# EAGLE design module_instr_reg (EAGLE 6.5.0)

## Sheet 1 of 4
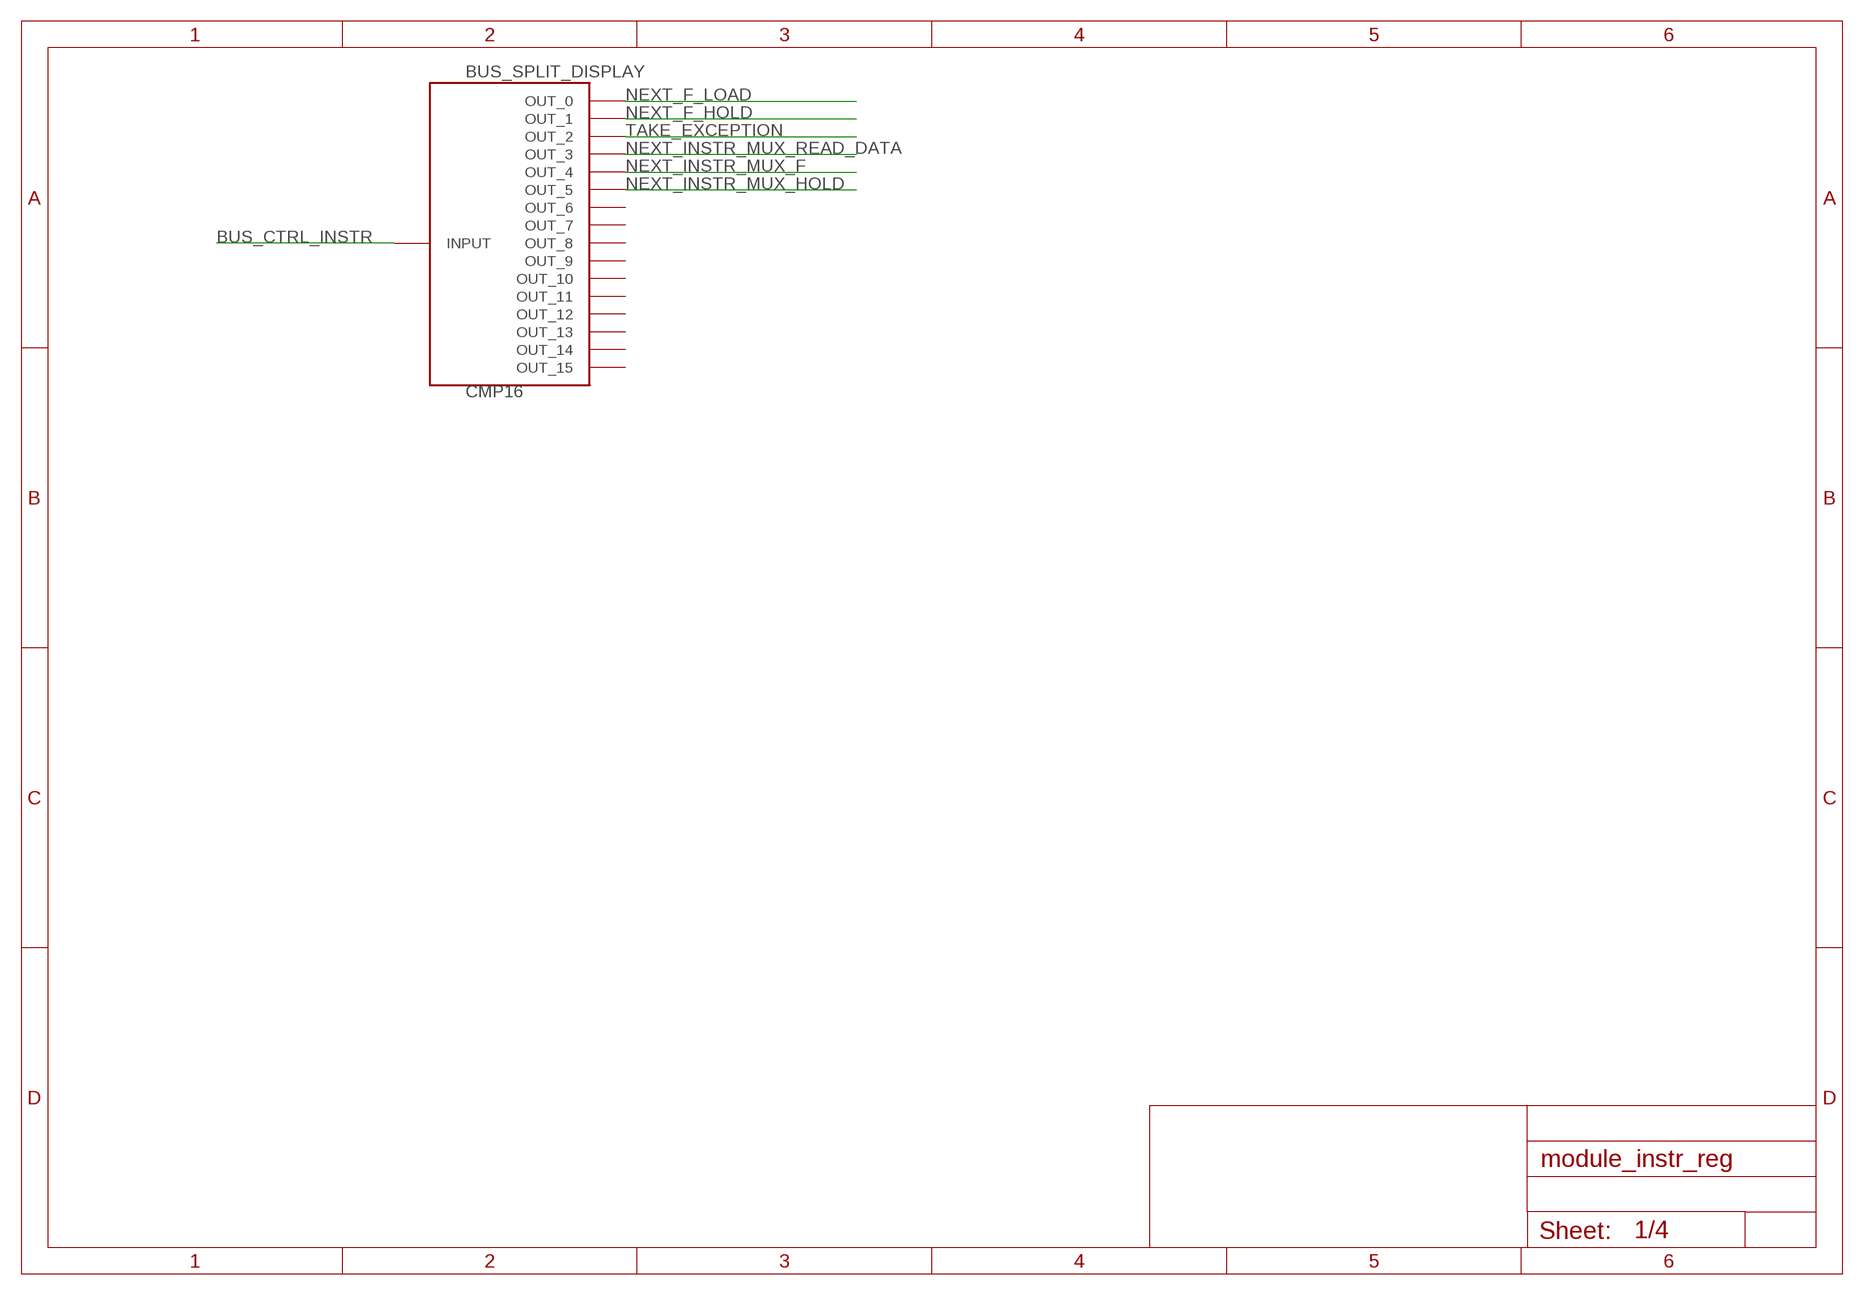
[diagram p0: schematic, sheet 1]

### Parts
CMP16  BUS_SPLIT_DISPLAY  [BUS_SPLIT_DISPLAY]

### Nets
BUS_CTRL_INSTR: CMP16.INPUT
NEXT_F_HOLD: CMP16.P$2(OUT_1) ; also sheet 2
NEXT_F_LOAD: CMP16.P$1(OUT_0) ; also sheet 2
NEXT_INSTR_MUX_F: CMP16.P$5(OUT_4) ; also sheet 2
NEXT_INSTR_MUX_HOLD: CMP16.P$6(OUT_5) ; also sheet 2
NEXT_INSTR_MUX_READ_DATA: CMP16.P$4(OUT_3) ; also sheet 2
TAKE_EXCEPTION: CMP16.P$3(OUT_2) ; also sheet 2
Unconnected: CMP16.P$7(OUT_6) CMP16.P$8(OUT_7) CMP16.P$9(OUT_8) CMP16.P$10(OUT_9) CMP16.P$11(OUT_10) CMP16.P$12(OUT_11) CMP16.P$13(OUT_12) CMP16.P$14(OUT_13) CMP16.P$15(OUT_14) CMP16.P$16(OUT_15)

## Sheet 2 of 4
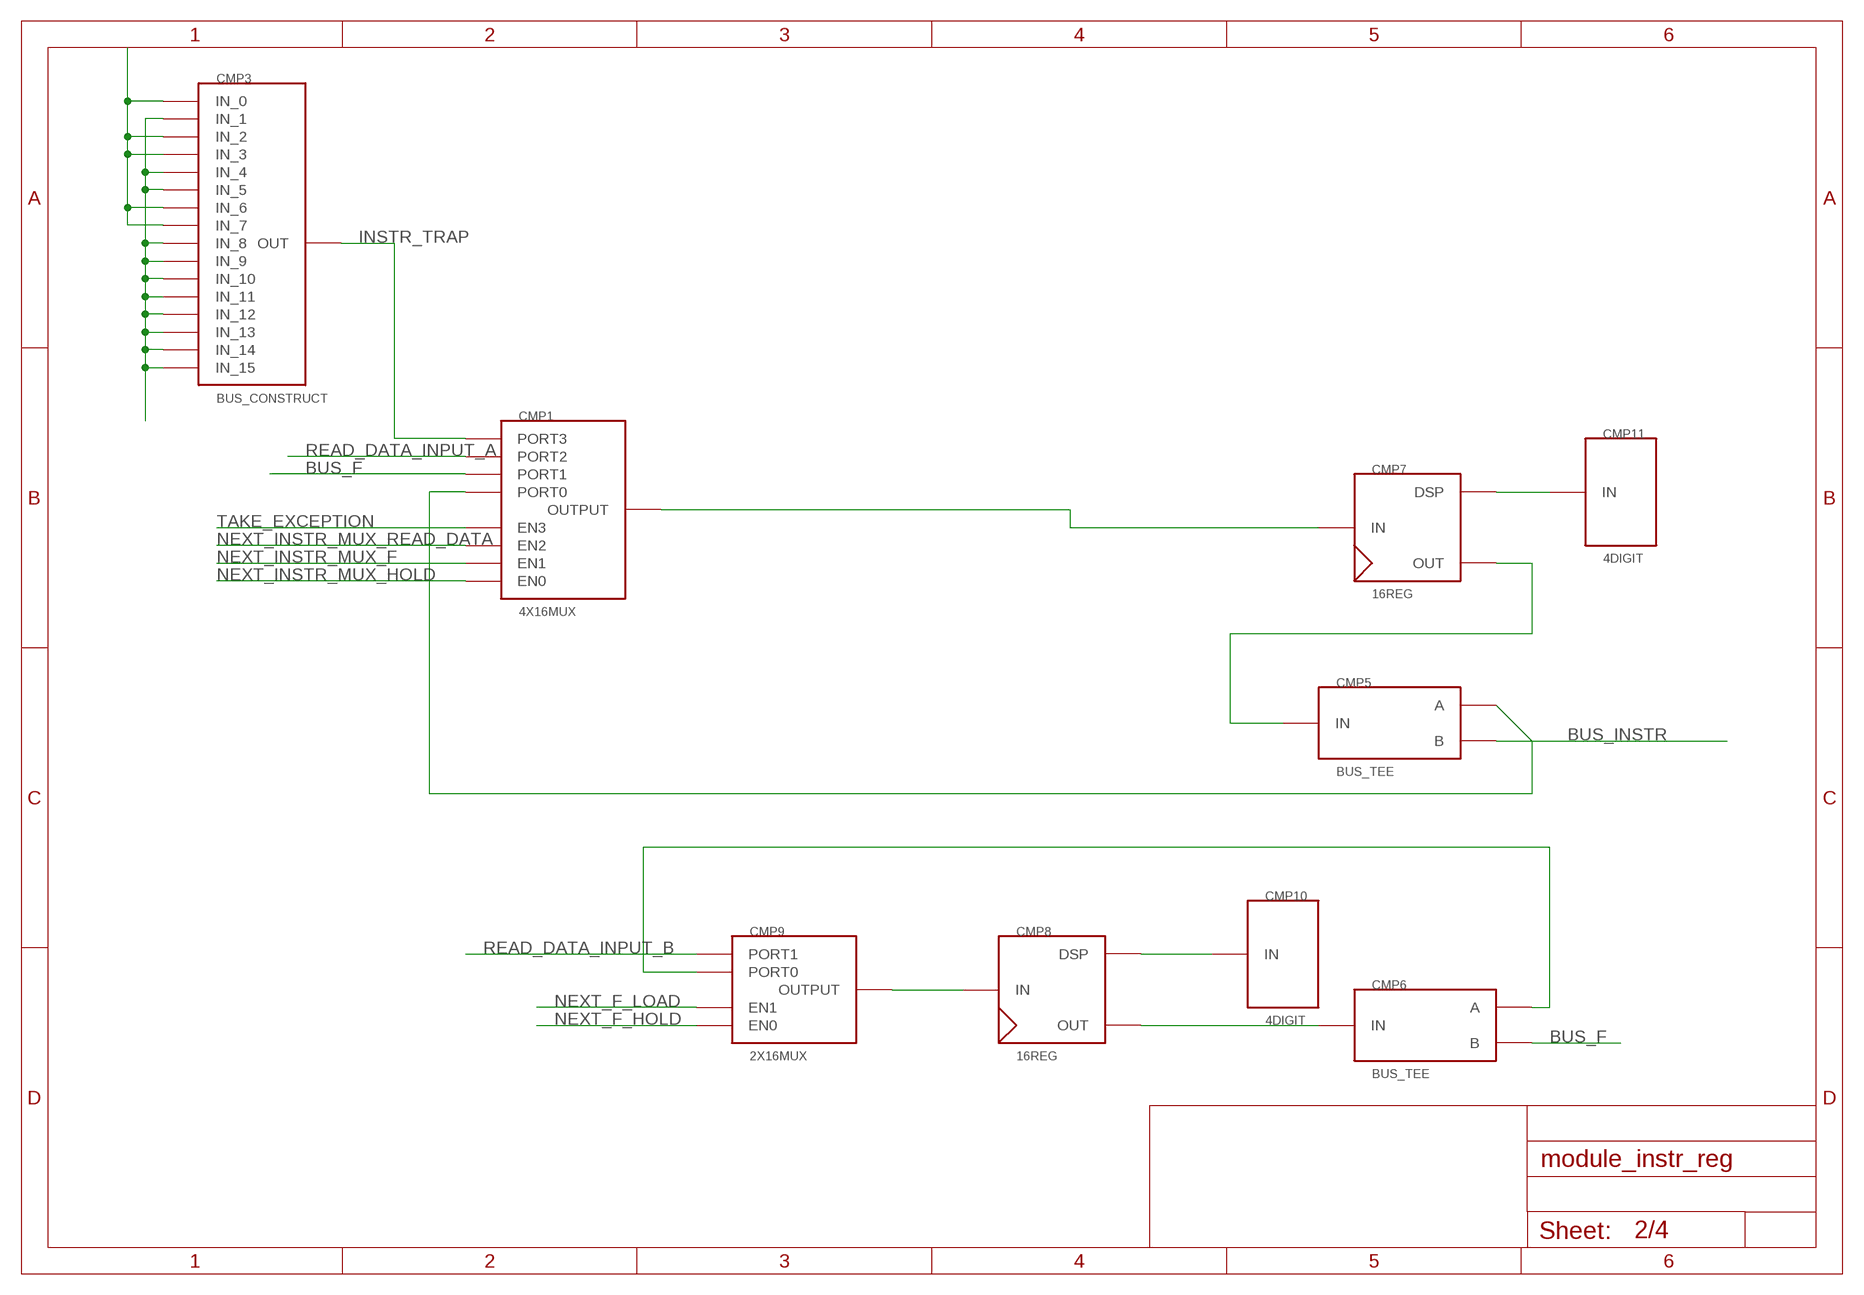
[diagram p1: schematic, sheet 2]

### Parts
CMP1  4X16MUX  [4X16MUX]
CMP3  BUS_CONSTRUCT  [BUS_SPLIT]
CMP5  BUS_TEE  [BUS_TEE]
CMP6  BUS_TEE  [BUS_TEE]
CMP7  16REG  [16REG]
CMP8  16REG  [16REG]
CMP9  2X16MUX  [2X16MUX]
CMP10  4DIGIT  [4DIGIT]
CMP11  4DIGIT  [4DIGIT]

### Nets
BUS_F: CMP1.PORT1 CMP6.OUTB(B)
BUS_INSTR: CMP5.OUTB(B) ; also sheet 4
INSTR_TRAP: CMP1.PORT3 CMP3.INPUT(OUT)
N$2: CMP8.INPUT(IN) CMP9.OUT(OUTPUT)
N$3: CMP8.DISPLAY(DSP) CMP10.P$1(IN)
N$4: CMP6.OUT_A(A) CMP9.PORT0
N$5: CMP1.PORTOUT(OUTPUT) CMP7.INPUT(IN)
N$8: CMP6.INPUT(IN) CMP8.OUT
N$11: CMP1.PORT0 CMP5.OUT_A(A)
N$19: CMP7.DISPLAY(DSP) CMP11.P$1(IN)
N$20: CMP5.INPUT(IN) CMP7.OUT
N$36: CMP3.P$2(IN_1) CMP3.P$5(IN_4) CMP3.P$6(IN_5) CMP3.P$9(IN_8) CMP3.P$10(IN_9) CMP3.P$11(IN_10) CMP3.P$12(IN_11) CMP3.P$13(IN_12) CMP3.P$14(IN_13) CMP3.P$15(IN_14) CMP3.P$16(IN_15)
N$37: CMP3.P$1(IN_0) CMP3.P$3(IN_2) CMP3.P$4(IN_3) CMP3.P$7(IN_6) CMP3.P$8(IN_7)
NEXT_F_HOLD: CMP9.EN0 ; also sheet 1
NEXT_F_LOAD: CMP9.EN1 ; also sheet 1
NEXT_INSTR_MUX_F: CMP1.EN1 ; also sheet 1
NEXT_INSTR_MUX_HOLD: CMP1.EN0 ; also sheet 1
NEXT_INSTR_MUX_READ_DATA: CMP1.EN2 ; also sheet 1
READ_DATA_INPUT_A: CMP1.PORT2 ; also sheet 3
READ_DATA_INPUT_B: CMP9.PORT1 ; also sheet 3
TAKE_EXCEPTION: CMP1.EN3 ; also sheet 1

## Sheet 3 of 4
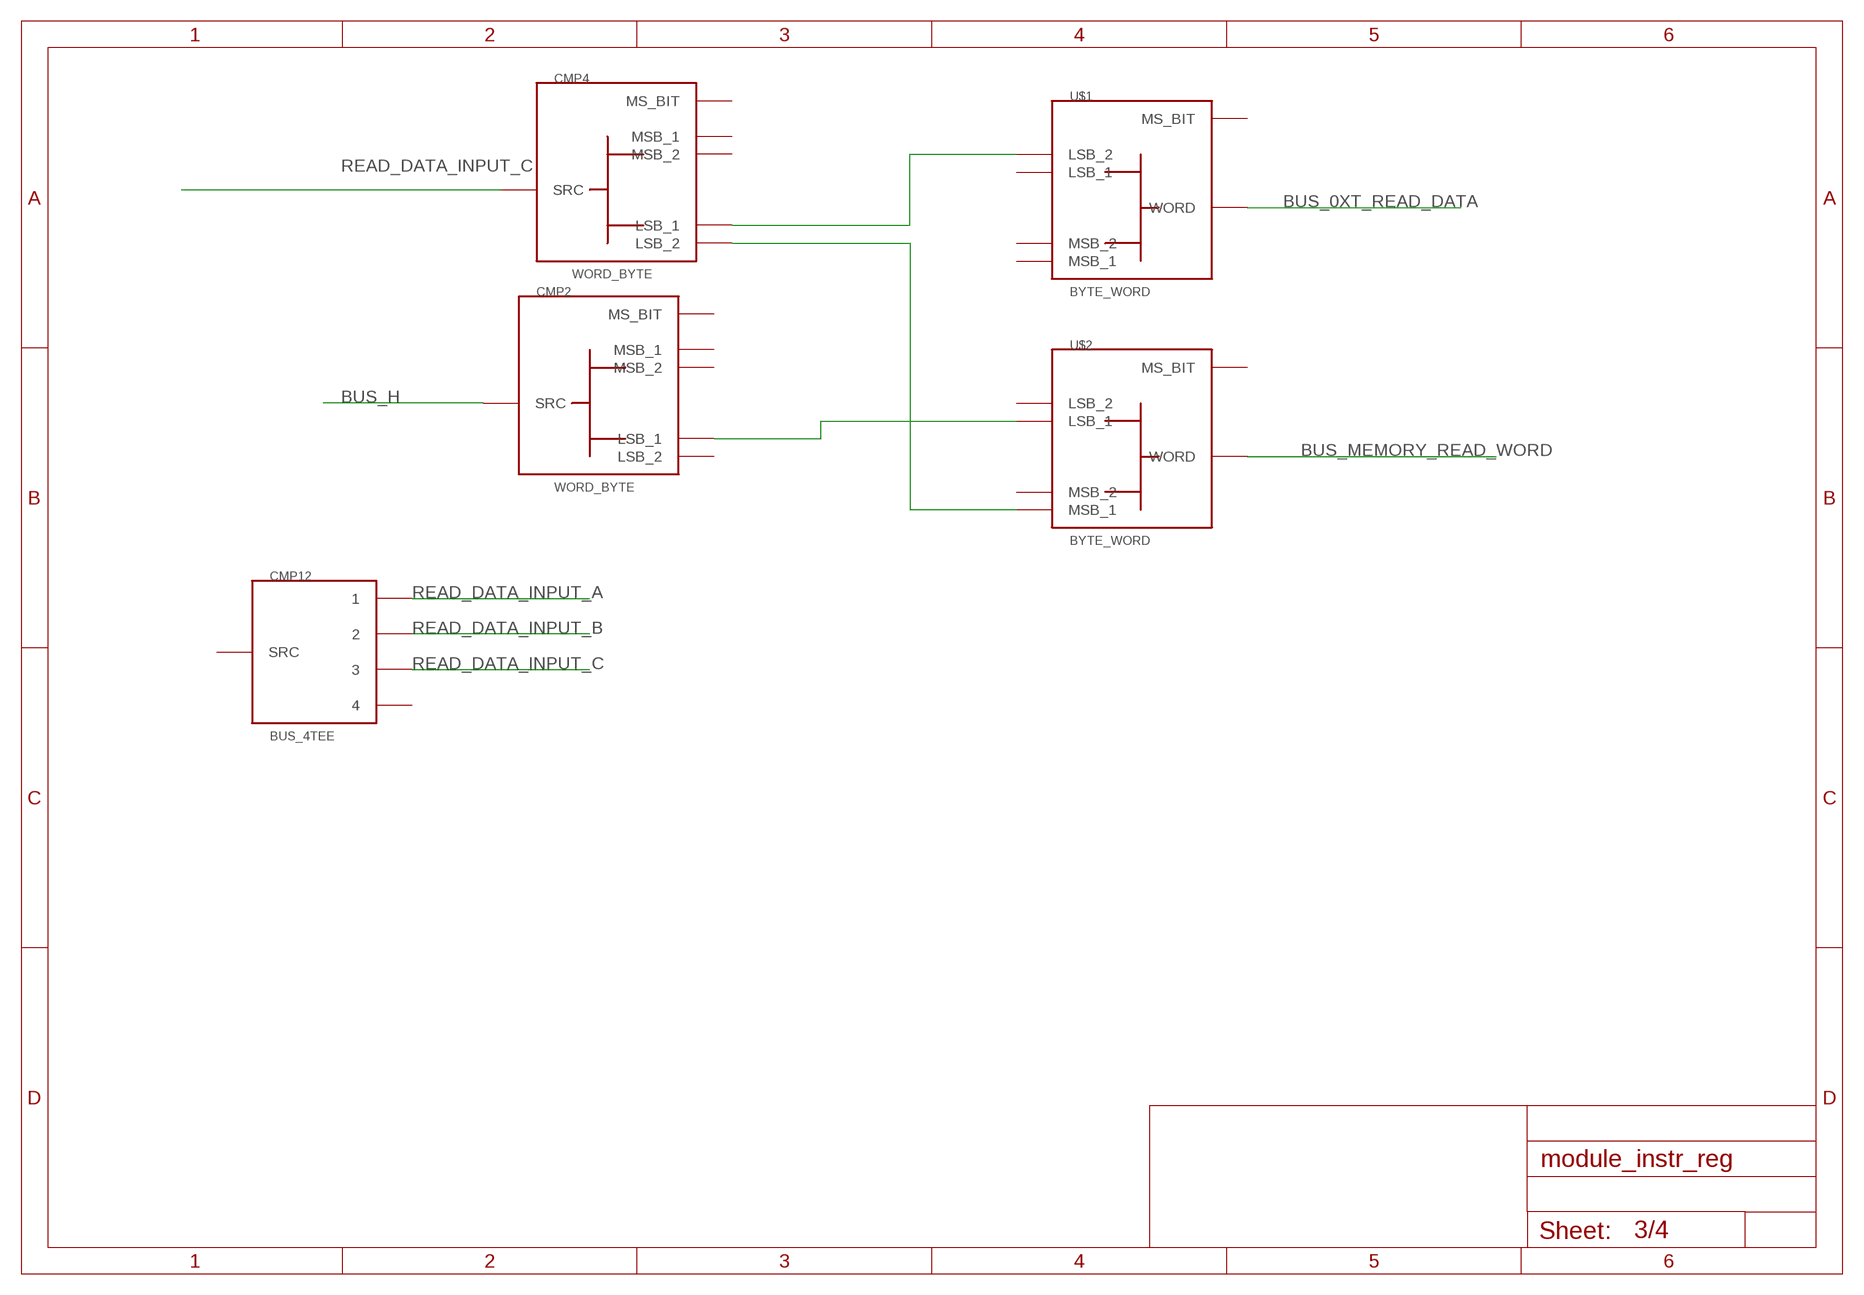
[diagram p2: schematic, sheet 3]

### Parts
CMP2  WORD_BYTE  [WORD_BYTE]
CMP4  WORD_BYTE  [WORD_BYTE]
CMP12  BUS_4TEE  [BUS_4TEE]
U$1  BYTE_WORD  [WORD_BYTE]
U$2  BYTE_WORD  [WORD_BYTE]

### Nets
BUS_0XT_READ_DATA: U$1.SRC(WORD)
BUS_H: CMP2.SRC
BUS_MEMORY_READ_WORD: U$2.SRC(WORD)
N$16: CMP2.LSB_1 U$2.LSB_1
N$18: CMP4.LSB_1 U$1.LSB_2
N$30: CMP4.LSB_2 U$2.MSB_1
READ_DATA_INPUT_A: CMP12.1 ; also sheet 2
READ_DATA_INPUT_B: CMP12.2 ; also sheet 2
READ_DATA_INPUT_C: CMP4.SRC CMP12.3
Unconnected: CMP2.LSB_2 CMP2.MS_BIT CMP2.MSB_1 CMP2.MSB_2 CMP4.MS_BIT CMP4.MSB_1 CMP4.MSB_2 CMP12.4 CMP12.SRC U$1.LSB_1 U$1.MS_BIT U$1.MSB_1 U$1.MSB_2 U$2.LSB_2 U$2.MS_BIT U$2.MSB_2

## Sheet 4 of 4
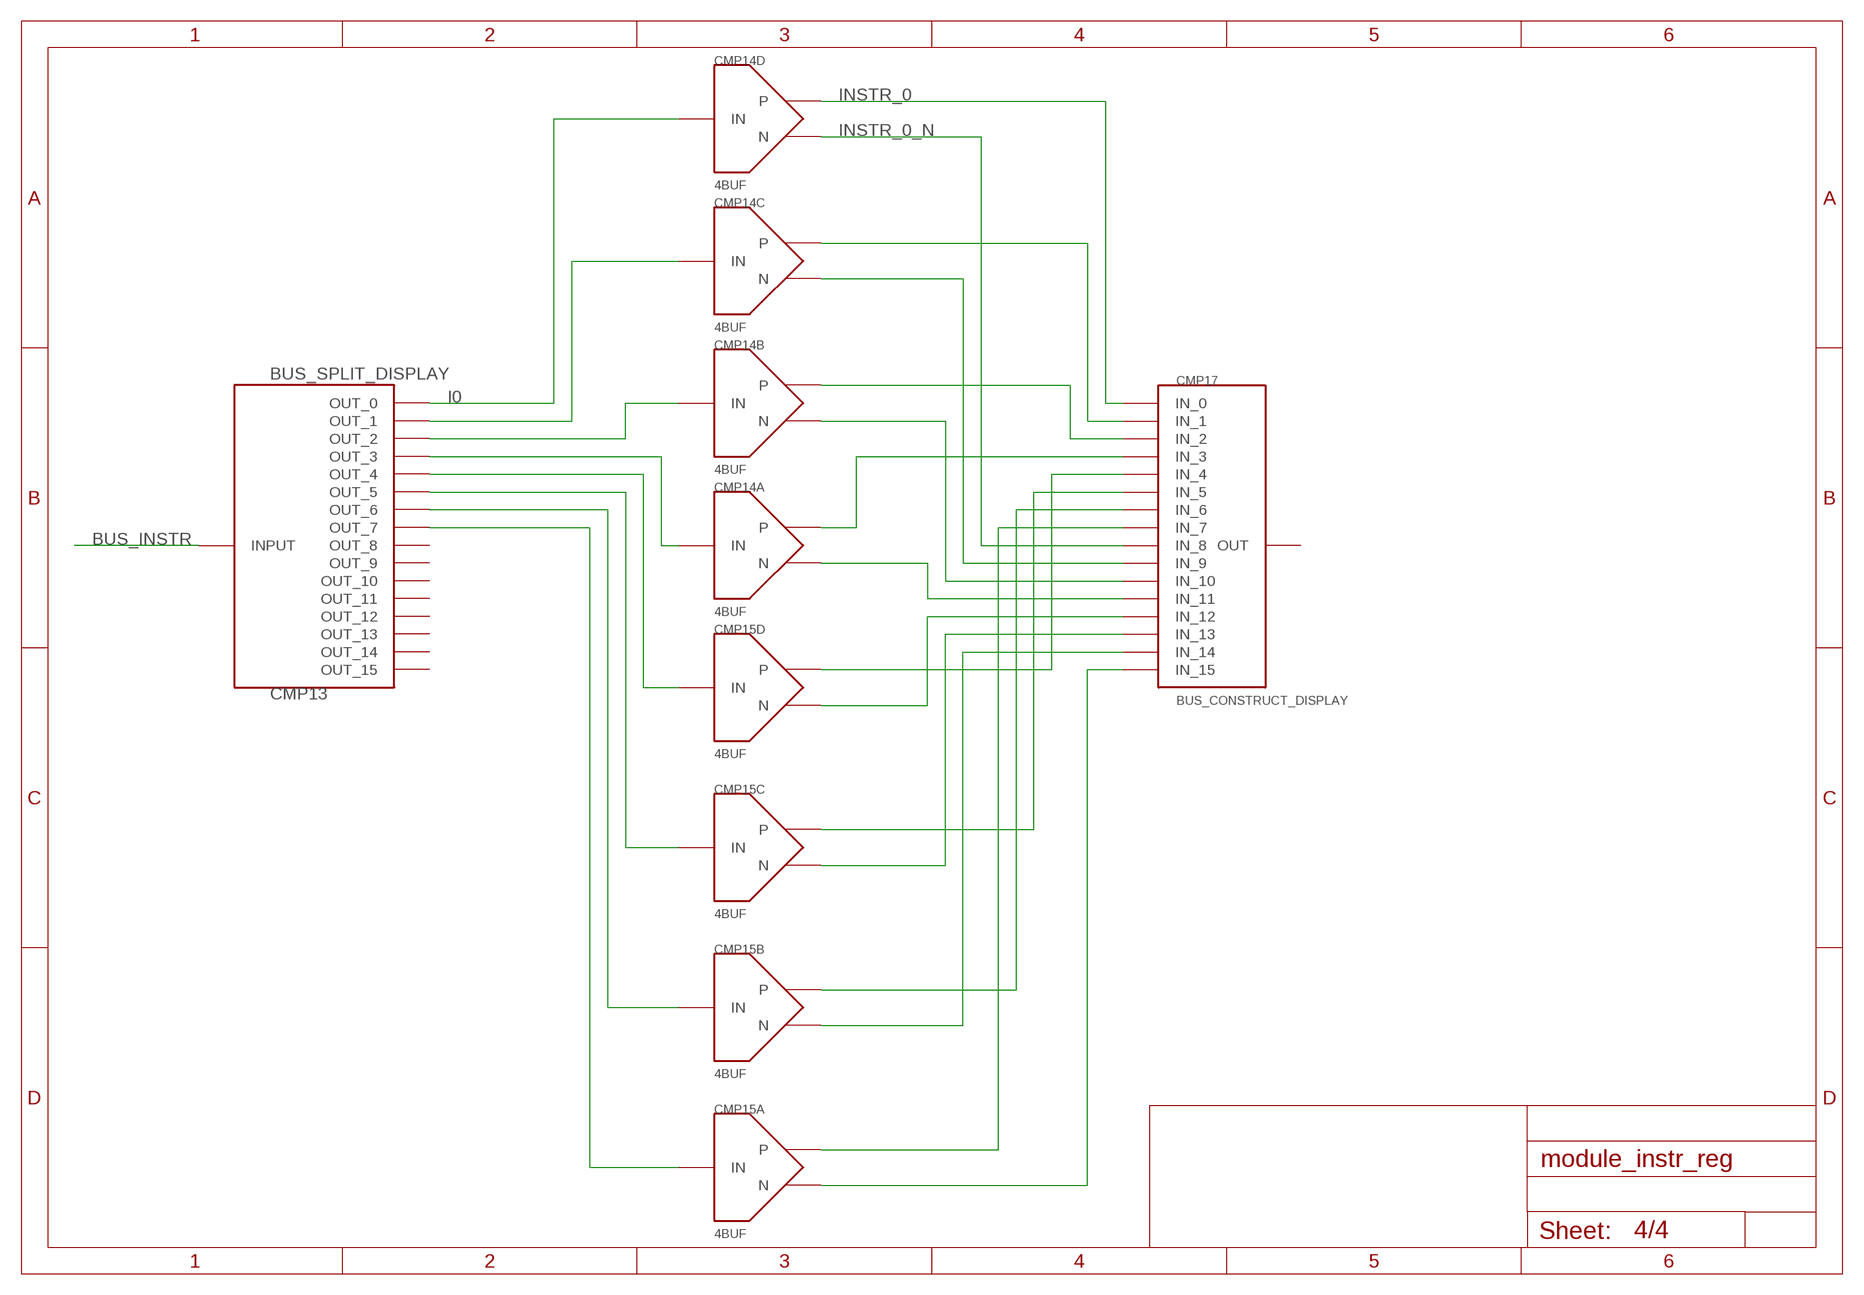
[diagram p3: schematic, sheet 4]

### Parts
CMP13  BUS_SPLIT_DISPLAY  [BUS_SPLIT_DISPLAY]
CMP14  4BUF  [4BUF]
CMP15  4BUF  [4BUF]
CMP17  BUS_CONSTRUCT_DISPLAY  [BUS_SPLIT_DISPLAY]

### Nets
BUS_INSTR: CMP13.INPUT ; also sheet 2
I0: CMP13.P$1(OUT_0) CMP14.A4(D:IN)
INSTR_0: CMP14.P4(D:P) CMP17.P$1(IN_0)
INSTR_0_N: CMP14.N4(D:N) CMP17.P$9(IN_8)
N$6: CMP13.P$2(OUT_1) CMP14.A3(C:IN)
N$7: CMP13.P$3(OUT_2) CMP14.A2(B:IN)
N$9: CMP13.P$4(OUT_3) CMP14.A1(A:IN)
N$10: CMP13.P$5(OUT_4) CMP15.A4(D:IN)
N$12: CMP13.P$6(OUT_5) CMP15.A3(C:IN)
N$13: CMP13.P$7(OUT_6) CMP15.A2(B:IN)
N$14: CMP13.P$8(OUT_7) CMP15.A1(A:IN)
N$17: CMP14.P3(C:P) CMP17.P$2(IN_1)
N$21: CMP14.P2(B:P) CMP17.P$3(IN_2)
N$22: CMP14.P1(A:P) CMP17.P$4(IN_3)
N$23: CMP15.P4(D:P) CMP17.P$5(IN_4)
N$24: CMP15.P3(C:P) CMP17.P$6(IN_5)
N$25: CMP15.P2(B:P) CMP17.P$7(IN_6)
N$26: CMP15.P1(A:P) CMP17.P$8(IN_7)
N$28: CMP14.N3(C:N) CMP17.P$10(IN_9)
N$29: CMP14.N2(B:N) CMP17.P$11(IN_10)
N$31: CMP14.N1(A:N) CMP17.P$12(IN_11)
N$32: CMP15.N4(D:N) CMP17.P$13(IN_12)
N$33: CMP15.N3(C:N) CMP17.P$14(IN_13)
N$34: CMP15.N2(B:N) CMP17.P$15(IN_14)
N$35: CMP15.N1(A:N) CMP17.P$16(IN_15)
Unconnected: CMP13.P$9(OUT_8) CMP13.P$10(OUT_9) CMP13.P$11(OUT_10) CMP13.P$12(OUT_11) CMP13.P$13(OUT_12) CMP13.P$14(OUT_13) CMP13.P$15(OUT_14) CMP13.P$16(OUT_15) CMP17.INPUT(OUT)

## Library data of the parts
CMP1 = modules:4X16MUX
CMP2 CMP4 = modules:WORD_BYTE
CMP3 = modules:BUS_CONSTRUCT
CMP5 CMP6 = modules:BUS_TEE
CMP7 CMP8 = modules:16REG
CMP9 = modules:2X16MUX
CMP10 CMP11 = modules:4DIGIT
CMP12 = modules:BUS_4TEE
CMP13 CMP16 = modules:BUS_SPLIT_DISPLAY
CMP14 CMP15 = modules:4BUF
CMP17 = modules:BUS_CONSTRUCT_DISPLAY
U$1 U$2 = modules:BYTE_WORD

## Board
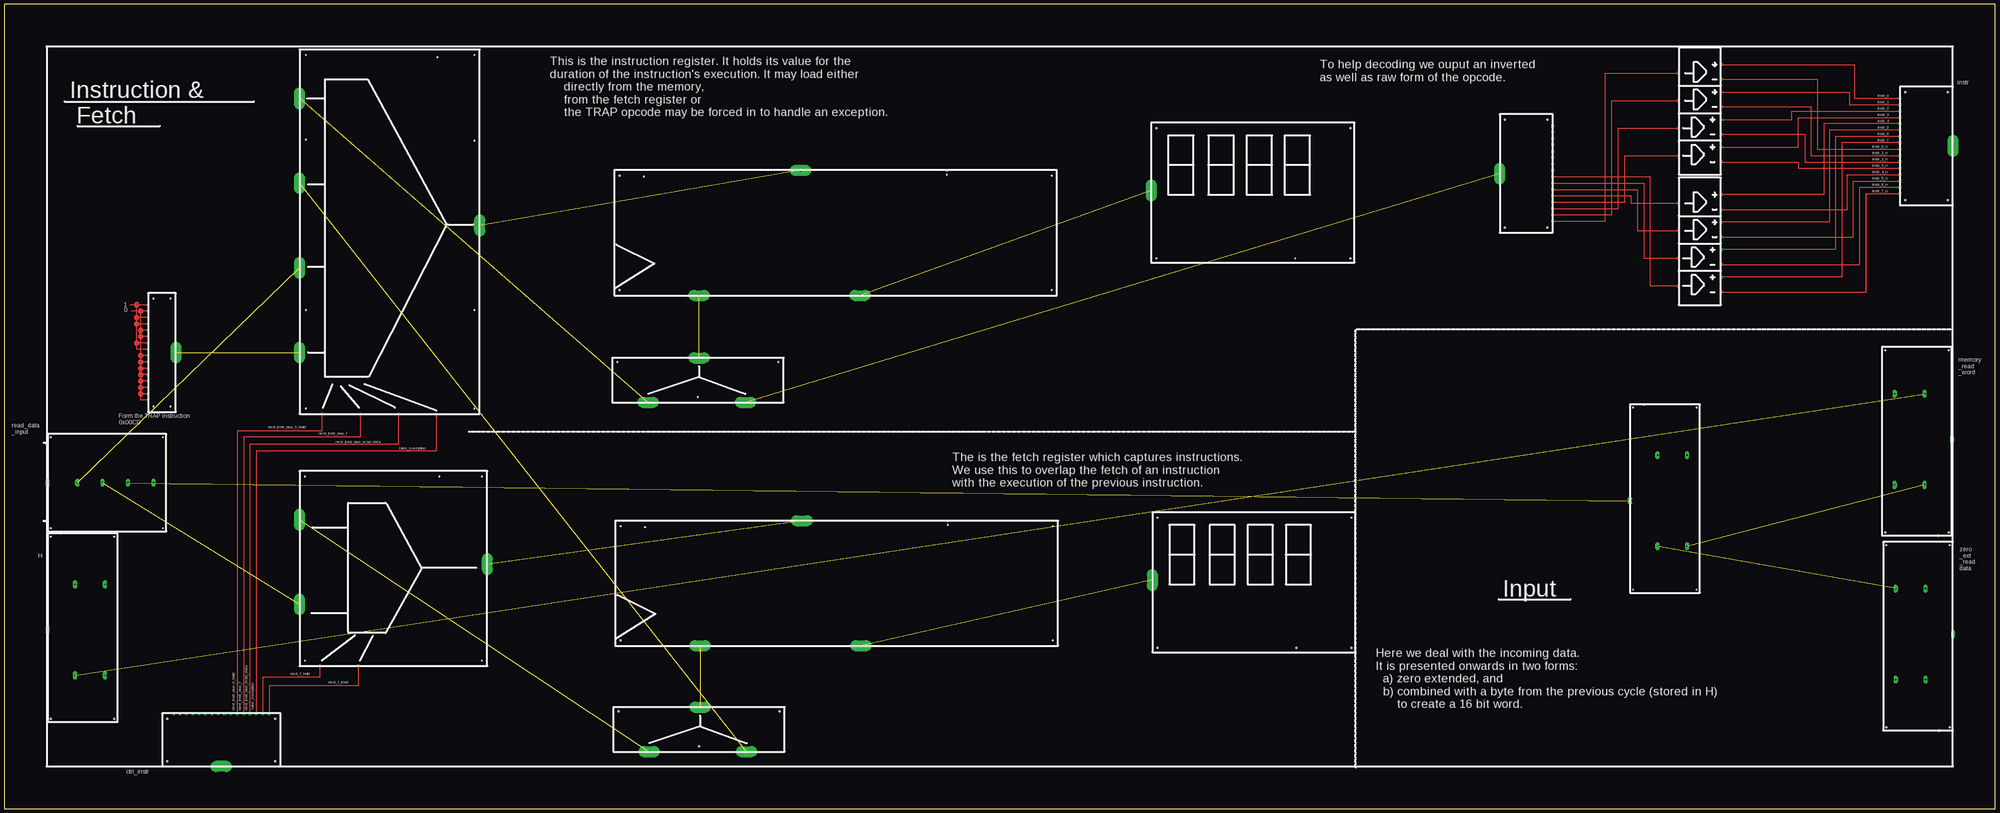
[diagram p4: board, top side]

Size 1193.8 x 482.6 mm. Coordinates in mm from the lower left corner, seen from the top.
Outline: 0,0 1193.8,0 1193.8,482.6 0,482.6 0,0
Copper layers (1*16): Top 0.035mm / dielectric 1.5mm / Bottom 0.035mm
Design rules "default": minimum track width 10mil, minimum drill 24mil, track to track 8mil, track to pad 8mil, pad to pad 8mil, via to via 8mil, smd to smd 8mil, copper to edge 40mil, drill to drill 8mil, minimum pad ring 10mil, minimum via ring 8mil, stop-mask expansion 4mil, vias tented up to drill 0mil, thermal gap 10mil
tKeepout: area 16.4,16.4 to 34.4,34.4; area 16.4,448.2 to 34.4,466.2; area 587.9,16.4 to 605.9,34.4; area 587.9,448.2 to 605.9,466.2; area 1159.4,16.4 to 1177.4,34.4; area 1159.4,448.2 to 1177.4,466.2

### Footprints (pad centres in the part's own frame; a part is rotated, then mirrored left to right if it is on the bottom)
4X16MUX = drill 0.8 square: EN0 -113.03,38.735; EN1 -113.03,15.875; EN2 -113.03,-6.985; EN3 -113.03,-29.845 | drill 0.8 pad 6.452 long: PORT0 76.2,52.07; PORT1 25.4,52.07; PORT2 -25.4,52.07; PORT3 -76.2,52.07; PORTOUT 0,-55.88 | hole 0.6: -109.855,-52.705; -50.8,-52.705; 50.8,-52.705; 102.235,-52.705; 102.235,48.26; 51.435,48.26; -50.8,48.26; -109.855,48.26; 100.965,-30.48
WORD_BYTE = drill 0.8 pad 2.54 long: LSB_1 -29.21,3.81; LSB_2 -29.21,-13.97; MSB_1 25.4,3.81; MSB_2 25.4,-13.97; SRC -1.905,20.32 | drill 0.8 square: MS_BIT 55.88,12.065 | hole 0.6: -55.245,-19.685; -55.245,18.415; 53.975,18.415; 53.975,-19.685
BUS_SPLIT = drill 0.8 pad 6.452 long: INPUT -0.635,7.62 | drill 0.8 square: P$1 -29.21,-8.89; P$2 -25.4,-8.89; P$3 -21.59,-8.89; P$4 -17.78,-8.89; P$5 -13.97,-8.89; P$6 -10.16,-8.89; P$7 -6.35,-8.89; P$8 -2.54,-8.89; P$9 1.27,-8.89; P$10 5.08,-8.89; P$11 8.89,-8.89; P$12 12.7,-8.89; P$13 16.51,-8.89; P$14 20.32,-8.89; P$15 24.13,-8.89; P$16 27.94,-8.89 | hole 0.6: -33.02,-5.715; -33.02,4.445; 31.75,4.445; 31.75,-5.715
BUS_TEE = drill 0.8 pad 6.452 long: INPUT 0,15.24; OUT_A -30.48,-11.43; OUTB 27.94,-11.43 | hole 0.6: -48.895,12.7; -0.635,-8.255; 47.625,12.7
16REG = drill 0.8 pad 6.452 long: DISPLAY 17.78,-33.02; INPUT -17.78,41.91; OUT -78.74,-33.02 | drill 0.8 square: P$1 69.85,41.91 | hole 0.6: -126.365,-29.845; -126.365,38.735; 132.715,38.735; 132.715,-29.845; -111.76,38.1; 69.85,39.37
2X16MUX = drill 0.8 square: EN0 -57.15,38.1; EN1 -57.15,15.24 | drill 0.8 pad 6.452 long: OUT 3.81,-62.23; PORT0 30.48,50.165; PORT1 -20.32,50.165 | hole 0.6: 56.515,46.99; -53.975,46.99; -53.975,-59.055; 56.515,-59.055; 56.515,-33.655
4DIGIT = drill 0.8 pad 6.452 long: P$1 -57.15,1.27 | hole 0.6: 29.21,-39.37; 62.23,-39.37; 62.23,38.735; -53.975,38.735; -53.975,-39.37
BUS_4TEE = drill 0.8 pad 2.54 long: 1 2.54,12.7; 2 2.54,-2.54; 3 2.54,-17.78; 4 2.54,-33.02; SRC 2.54,30.48 | hole 0.6: -24.765,28.575; 29.845,28.575; 29.845,-38.735; -24.765,-38.735
BUS_SPLIT_DISPLAY = drill 0.8 pad 6.452 long: INPUT 0,15.24 | drill 0.8 square: P$1 -28.575,-16.51; P$2 -24.765,-16.51; P$3 -20.955,-16.51; P$4 -17.145,-16.51; P$5 -13.335,-16.51; P$6 -9.525,-16.51; P$7 -5.715,-16.51; P$8 -1.905,-16.51; P$9 1.905,-16.51; P$10 5.715,-16.51; P$11 9.525,-16.51; P$12 13.335,-16.51; P$13 17.145,-16.51; P$14 20.955,-16.51; P$15 24.765,-16.51; P$16 28.575,-16.51 | hole 0.6: -32.385,-13.335; -32.385,12.065; 32.385,12.065; 32.385,-13.335
4BUF = drill 0.8 square: A1 -25.4,13.97; A2 -8.89,13.97; A3 7.62,13.97; A4 24.13,13.97; N1 -29.21,-11.43; N2 -12.7,-11.43; N3 3.81,-11.43; N4 20.32,-11.43; P1 -20.32,-11.43; P2 -3.81,-11.43; P3 12.7,-11.43; P4 29.21,-11.43

### Placement (x,y rotation side)
CMP1  229.24,349.88 90 top
CMP2  46.35,109.22 90 top
CMP3  95.25,273.05 270 top
CMP4  995.04,186.69 90 top
CMP5  416.56,255.27 0 top
CMP6  417.19,45.72 0 top
CMP7  495.3,341 0 top
CMP8  495.94,130.81 0 top
CMP9  227.33,142.88 90 top
CMP10  745.49,135.89 0 top
CMP11  744.86,369.57 0 top
CMP12  56.52,193.04 90 top
CMP13  911.86,381 90 top
CMP14  1017.9,417.19 90 top
CMP15  1017.9,339.09 90 top
CMP16  130.18,40.64 180 top
CMP17  1153.16,397.51 270 top
U$1  1148.08,102.87 270 top
U$2  1147.44,219.71 270 top

### Tracks (layer width: path | path; a pad name or v marks a point on that pad's centre or on a via)
BUS_F  (1 unrouted)
BUS_INSTR  (1 unrouted)
I0
  Top 0.61: CMP13.P$1 960.12,352.43 960.12,441.32 CMP14.A4
INSTR_0
  Top 0.61: CMP14.P4 1109.35,446.4 1109.35,426.08 CMP17.P$1
INSTR_0_N
  Top 0.61: CMP14.N4 1087.12,437.51 1087.12,395.61 CMP17.P$9
INSTR_TRAP  (1 unrouted)
N$2  (1 unrouted)
N$3  (1 unrouted)
N$4  (1 unrouted)
N$5  (1 unrouted)
N$6
  Top 0.61: CMP13.P$2 963.93,356.24 963.93,424.81 CMP14.A3
N$7
  Top 0.61: CMP13.P$3 967.74,360.05 967.74,408.31 CMP14.A2
N$8  (1 unrouted)
N$9
  Top 0.61: CMP13.P$4 971.55,363.86 971.55,391.8 CMP14.A1
N$10
  Top 0.61: CMP13.P$5 975.36,367.67 975.36,363.22 CMP15.A4
N$11  (1 unrouted)
N$12
  Top 0.61: CMP13.P$6 979.17,371.48 979.17,346.71 CMP15.A3
N$13
  Top 0.61: CMP13.P$7 982.98,375.29 982.98,330.2 CMP15.A2
N$14
  Top 0.61: CMP13.P$8 986.79,379.1 986.79,313.69 CMP15.A1
N$16  (1 unrouted)
N$17
  Top 0.61: CMP14.P3 1106.17,429.89 1106.17,422.27 CMP17.P$2
N$18  (1 unrouted)
N$19  (1 unrouted)
N$20  (1 unrouted)
N$21
  Top 0.61: CMP14.P2 1071.88,413.38 1071.88,418.46 CMP17.P$3
N$22
  Top 0.61: CMP14.P1 1075.69,396.88 1075.69,414.65 CMP17.P$4
N$23
  Top 0.61: CMP17.P$5 1090.93,410.85 1090.93,368.3 CMP15.P4
N$24
  Top 0.61: CMP17.P$6 1094.11,407.04 1094.11,351.79 CMP15.P3
N$25
  Top 0.61: CMP17.P$7 1097.91,403.23 1097.91,335.28 CMP15.P2
N$26
  Top 0.61: CMP17.P$8 1101.72,399.42 1101.72,318.77 CMP15.P1
N$28
  Top 0.61: CMP14.N3 1083.31,421 1083.31,391.8 CMP17.P$10
N$29
  Top 0.61: CMP14.N2 1079.5,404.5 1079.5,387.99 CMP17.P$11
N$30  (1 unrouted)
N$31
  Top 0.61: CMP14.N1 1075.69,387.99 1075.69,384.18 CMP17.P$12
N$32
  Top 0.61: CMP15.N4 1104.9,359.41 1104.9,380.37 CMP17.P$13
N$33
  Top 0.61: CMP15.N3 1108.71,342.9 1108.71,376.56 CMP17.P$14
N$34
  Top 0.61: CMP15.N2 1112.52,326.39 1112.52,372.75 CMP17.P$15
N$35
  Top 0.61: CMP15.N1 1116.33,309.88 1116.33,368.94 CMP17.P$16
N$36
  Top 0.61: CMP3.P$2 81.92,298.45 | 81.92,298.45 76.2,298.45 | CMP3.P$16 81.92,245.11 81.92,248.92 | 81.92,248.92 81.92,252.73 | 81.92,252.73 81.92,256.54 | 81.92,256.54 81.92,260.35 | 81.92,260.35 81.92,264.16 | 81.92,264.16 81.92,267.97 | 81.92,267.97 81.92,271.78 | 81.92,271.78 81.92,283.21 | 81.92,283.21 81.92,287.02 | 81.92,287.02 81.92,298.45 | CMP3.P$5 81.92,287.02 | CMP3.P$6 81.92,283.21 | CMP3.P$9 81.92,271.78 | CMP3.P$10 81.92,267.97 | CMP3.P$11 81.92,264.16 | CMP3.P$12 81.92,260.35 | CMP3.P$13 81.92,256.54 | CMP3.P$14 81.92,252.73 | CMP3.P$15 81.92,248.92
N$37
  Top 0.61: CMP3.P$1 79.38,302.26 | 79.38,302.26 75.56,302.26 | CMP3.P$3 79.38,294.64 | 79.38,294.64 79.38,302.26 | CMP3.P$7 79.38,279.4 | 79.38,279.4 79.38,290.83 | 79.38,290.83 79.38,294.64 | CMP3.P$4 79.38,290.83 | CMP3.P$8 79.38,275.59 79.38,279.4
NEXT_F_HOLD
  Top 0.61: CMP9.EN0 189.23,78.74 154.94,78.74 CMP16.P$2
NEXT_F_LOAD
  Top 0.61: CMP9.EN1 212.09,73.66 158.75,73.66 CMP16.P$1
NEXT_INSTR_MUX_F
  Top 0.61: CMP1.EN1 213.36,222.88 143.51,222.88 CMP16.P$5
NEXT_INSTR_MUX_HOLD
  Top 0.61: CMP1.EN0 190.5,226.69 139.7,226.69 CMP16.P$6
NEXT_INSTR_MUX_READ_DATA
  Top 0.61: CMP1.EN2 236.22,218.44 147.32,218.44 CMP16.P$4
READ_DATA_INPUT_A  (1 unrouted)
READ_DATA_INPUT_B  (1 unrouted)
READ_DATA_INPUT_C  (1 unrouted)
TAKE_EXCEPTION
  Top 0.61: CMP1.EN3 259.08,214.63 151.13,214.63 CMP16.P$3
(copper drawn outside any net)
  shapes: Top circle x14

### Text on the board
tPlace: To help decoding we ouput an inverted / as well as raw form of the opcode. | instr | instr_0 | instr_1 | instr_2 | This is the instruction register. It holds its value for the / duration of the instruction's execution. It may load either / directly from the memory, / from the fetch register or / the TRAP opcode may be forced in to handle an exception. | instr_3 | Instruction & / Fetch | instr_4 | instr_5 | instr_6 | instr_7 | instr_0_n | instr_1_n | instr_2_n | instr_3_n | instr_4_n | instr_5_n | instr_6_n | instr_7_n | 1 | 0 | memory / _read / _word | Form the TRAP instruction / 0x00CD | next_instr_mux_h_hold | read_data / _input | next_instr_mux_f | next_instr_mux_read_data | take_exception | The is the fetch register which captures instructions. / We use this to overlap the fetch of an instruction / with the execution of the previous instruction. | H | zero / _ext / _read / data | Input | next_f_hold | next_f_load | take_exception | next_instr_mux_h_hold | next_instr_mux_f | next_instr_mux_read_data | Here we deal with the incoming data. / It is presented onwards in two forms: / a) zero extended, and / b) combined with a byte from the previous cycle (stored in H) / to create a 16 bit word. | ctrl_instr